# EAGLE design level_shift_panel (EAGLE 9.4.2)
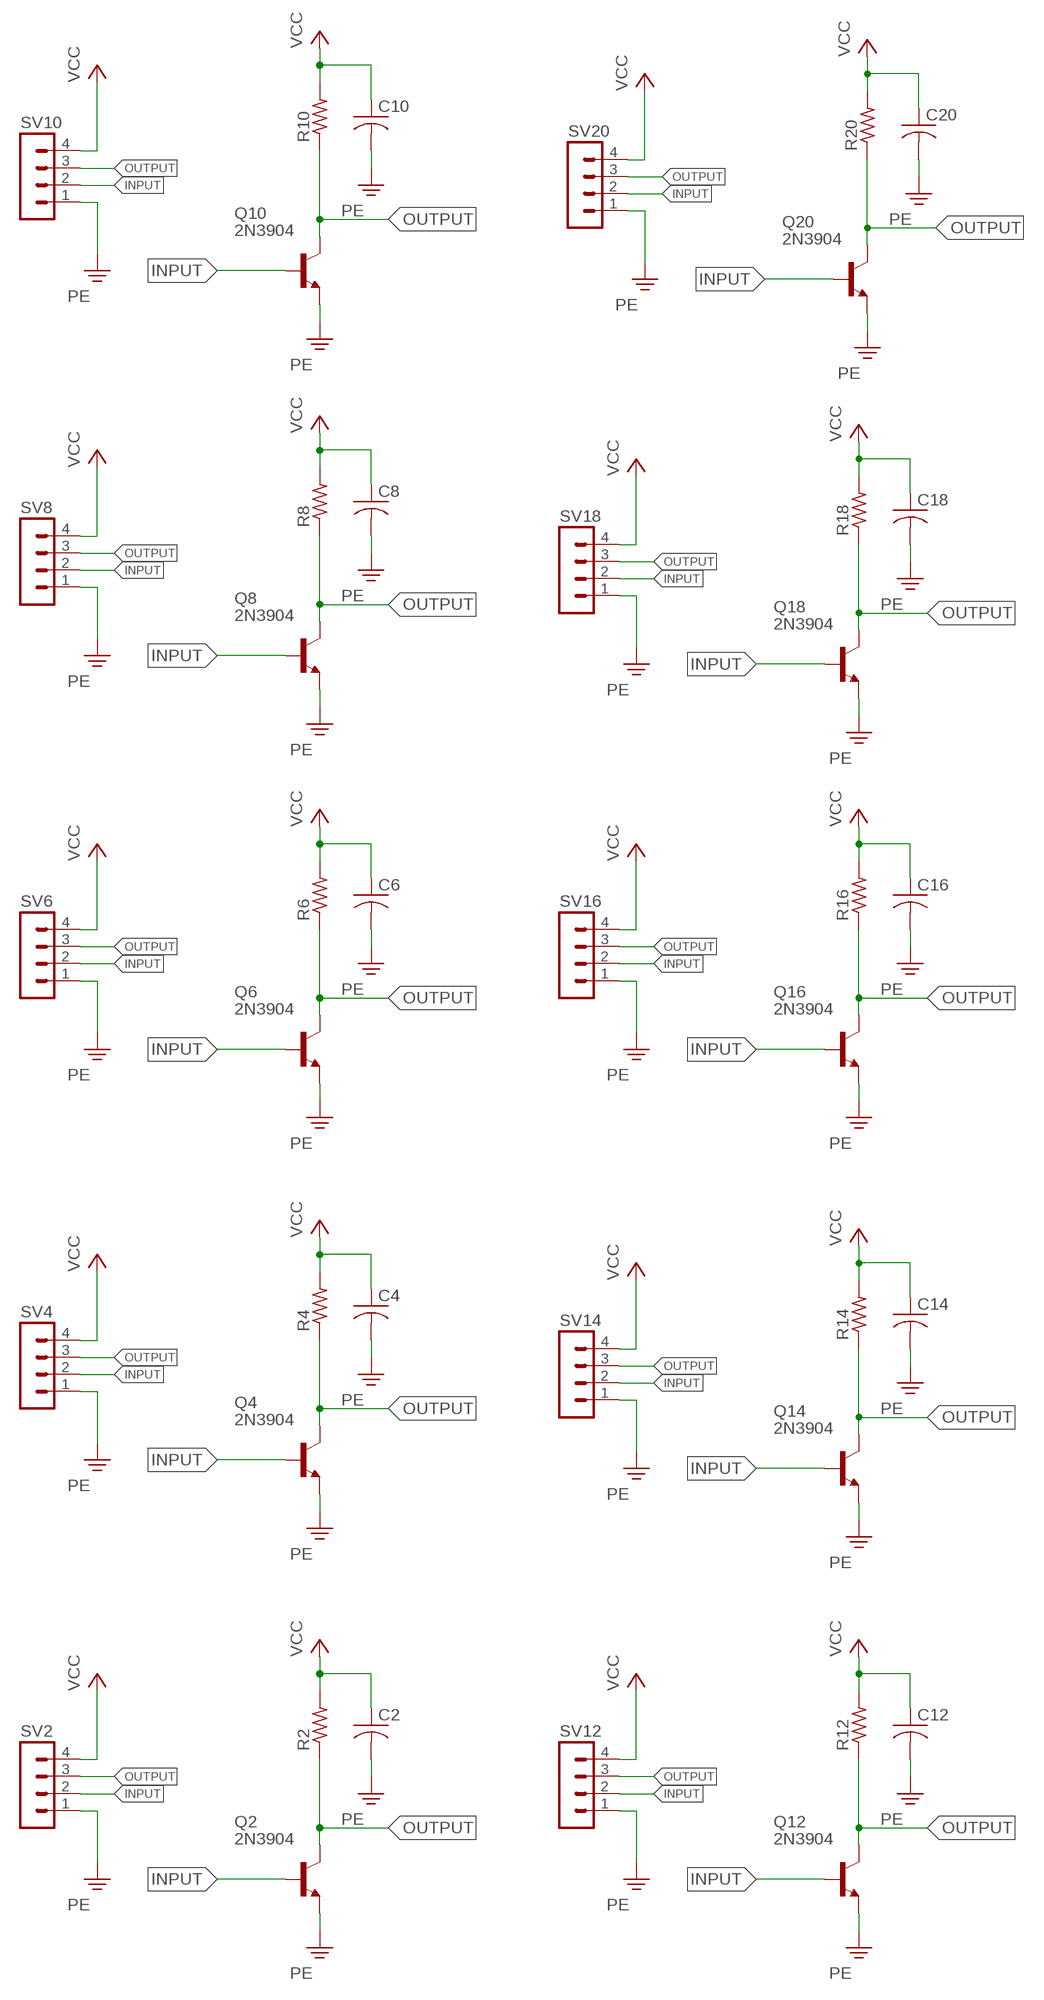
[diagram p0: schematic, sheet 1]

## Parts
C2  C-US025-030X050  [C025-030X050]
C4  C-US025-030X050  [C025-030X050]
C6  C-US025-030X050  [C025-030X050]
C8  C-US025-030X050  [C025-030X050]
C10  C-US025-030X050  [C025-030X050]
C12  C-US025-030X050  [C025-030X050]
C14  C-US025-030X050  [C025-030X050]
C16  C-US025-030X050  [C025-030X050]
C18  C-US025-030X050  [C025-030X050]
C20  C-US025-030X050  [C025-030X050]
Q2  2N3904  [TO-92]
Q4  2N3904  [TO-92]
Q6  2N3904  [TO-92]
Q8  2N3904  [TO-92]
Q10  2N3904  [TO-92]
Q12  2N3904  [TO-92]
Q14  2N3904  [TO-92]
Q16  2N3904  [TO-92]
Q18  2N3904  [TO-92]
Q20  2N3904  [TO-92]
R2  R-US_0204/7  [0204/7]
R4  R-US_0204/7  [0204/7]
R6  R-US_0204/7  [0204/7]
R8  R-US_0204/7  [0204/7]
R10  R-US_0204/7  [0204/7]
R12  R-US_0204/7  [0204/7]
R14  R-US_0204/7  [0204/7]
R16  R-US_0204/7  [0204/7]
R18  R-US_0204/7  [0204/7]
R20  R-US_0204/7  [0204/7]
SV2  MA04-1  [MA04-1]
SV4  MA04-1  [MA04-1]
SV6  MA04-1  [MA04-1]
SV8  MA04-1  [MA04-1]
SV10  MA04-1  [MA04-1]
SV12  MA04-1  [MA04-1]
SV14  MA04-1  [MA04-1]
SV16  MA04-1  [MA04-1]
SV18  MA04-1  [MA04-1]
SV20  MA04-1  [MA04-1]

## Nets
INPUT: Q2.B Q4.B Q6.B Q8.B Q10.B Q12.B Q14.B Q16.B Q18.B Q20.B SV2.2 SV4.2 SV6.2 SV8.2 SV10.2 SV12.2 SV14.2 SV16.2 SV18.2 SV20.2
OUTPUT: Q2.C Q4.C Q6.C Q8.C Q10.C Q12.C Q14.C Q16.C Q18.C Q20.C R2.1 R4.1 R6.1 R8.1 R10.1 R12.1 R14.1 R16.1 R18.1 R20.1 SV2.3 SV4.3 SV6.3 SV8.3 SV10.3 SV12.3 SV14.3 SV16.3 SV18.3 SV20.3
PE: C2.2 C4.2 C6.2 C8.2 C10.2 C12.2 C14.2 C16.2 C18.2 C20.2 Q2.E Q4.E Q6.E Q8.E Q10.E Q12.E Q14.E Q16.E Q18.E Q20.E SV2.1 SV4.1 SV6.1 SV8.1 SV10.1 SV12.1 SV14.1 SV16.1 SV18.1 SV20.1
VCC: C2.1 C4.1 C6.1 C8.1 C10.1 C12.1 C14.1 C16.1 C18.1 C20.1 R2.2 R4.2 R6.2 R8.2 R10.2 R12.2 R14.2 R16.2 R18.2 R20.2 SV2.4 SV4.4 SV6.4 SV8.4 SV10.4 SV12.4 SV14.4 SV16.4 SV18.4 SV20.4

## Library data of the parts
C2 C4 C6 C8 C10 C12 C14 C16 C18 C20 = rcl:C-US: CAPACITOR, American symbol; SPICEPREFIX: C
Q2 Q4 Q6 Q8 Q10 Q12 Q14 Q16 Q18 Q20 = transistors:2N3904
R2 R4 R6 R8 R10 R12 R14 R16 R18 R20 = rcl:R-US_: RESISTOR, American symbol; SPICEPREFIX: R
SV2 SV4 SV6 SV8 SV10 SV12 SV14 SV16 SV18 SV20 = con-lstb:MA04-1: PIN HEADER; OC_FARNELL: unknown; OC_NEWARK: unknown

## Board
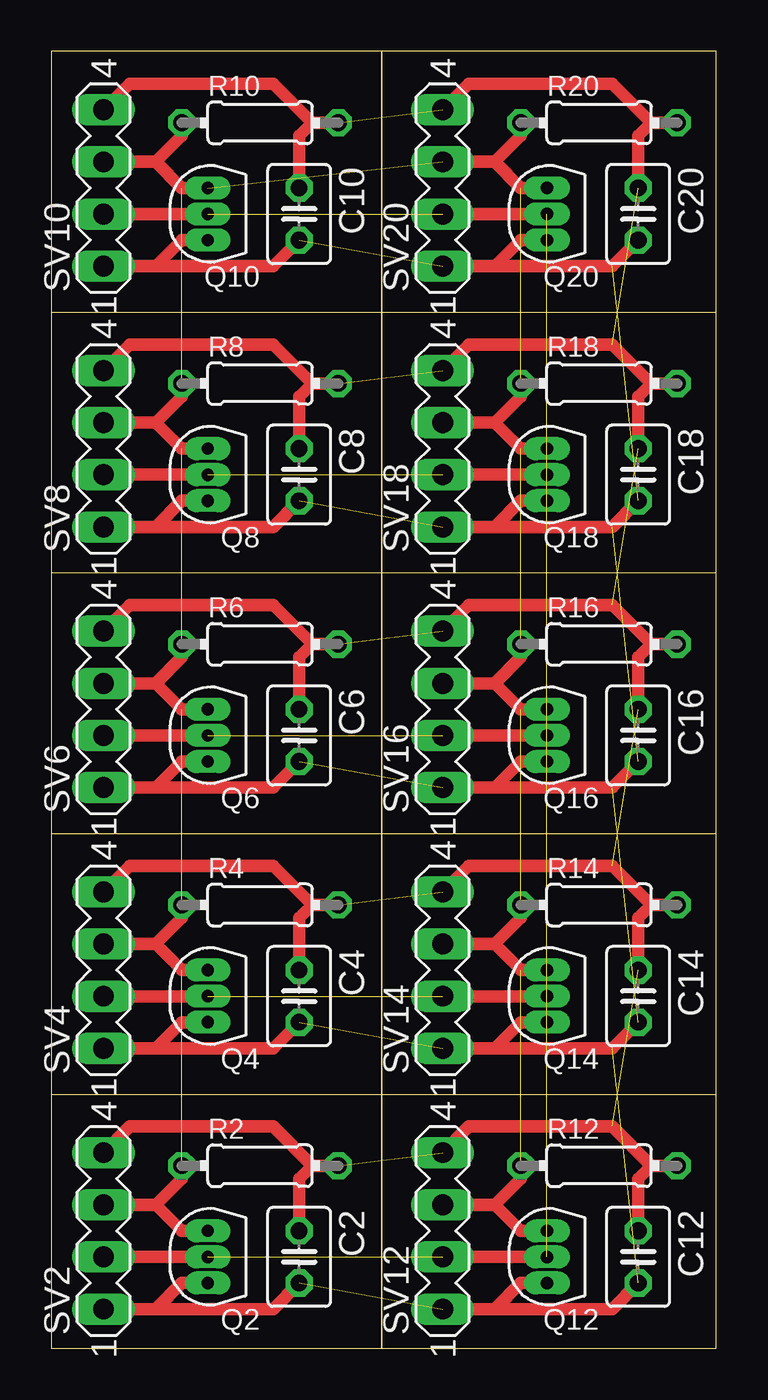
[diagram p1: board, top side]

Size 32.38 x 63.17 mm. Coordinates in mm from the lower left corner, seen from the top.
Outline: 16.08,0 0,0 0,12.37
Outline: 16.08,0 16.08,12.37
Outline: 0,12.37 16.08,12.37
Outline: 16.08,12.37 16.08,25.07
Outline: 0,25.07 0,12.37
Outline: 0,25.07 16.08,25.07
Outline: 16.08,25.07 16.08,37.77
Outline: 0,37.77 0,25.07
Outline: 0,37.77 16.08,37.77
Outline: 16.08,37.77 16.08,50.47
Outline: 0,50.47 0,37.77
Outline: 0,50.47 16.08,50.47
Outline: 16.08,50.47 16.08,63.17
Outline: 16.08,63.17 0,63.17 0,50.47
Outline: 16.08,0 32.37,0 32.37,12.37
Outline: 16.08,12.37 16.08,0
Outline: 16.08,12.37 32.37,12.37
Outline: 32.37,12.37 32.37,25.07
Outline: 16.08,25.07 16.08,12.37
Outline: 16.08,25.07 32.37,25.07
Outline: 32.37,25.07 32.37,37.77
Outline: 16.08,37.77 16.08,25.07
Outline: 16.08,37.77 32.37,37.77
Outline: 32.37,37.77 32.38,50.47
Outline: 16.08,50.47 16.08,37.77
Outline: 16.08,50.47 32.38,50.47
Outline: 32.38,50.47 32.38,63.17 16.08,63.17
Outline: 16.08,63.17 16.08,50.47
Copper layers (1*16): Top 0.035mm / dielectric 1.5mm / Bottom 0.035mm
Design rules "default": minimum track width 6mil, minimum drill 0.35mm, track to track 6mil, track to pad 6mil, pad to pad 6mil, via to via 6mil, smd to smd 6mil, copper to edge 40mil, drill to drill 6mil, minimum pad ring 10mil, minimum via ring 8mil, stop-mask expansion 4mil, vias tented up to drill 0mil, thermal gap 10mil

### Footprints (pad centres in the part's own frame; a part is rotated, then mirrored left to right if it is on the bottom)
C025-030X050 = drill 0.813 octagon: 1 -1.27,0; 2 1.27,0
TO-92 = drill 0.6 pad 0.762 long: B 0,0; C 0,-1.27; E 0,1.27
0204/7 = drill 0.813 octagon: 1 -3.81,0; 2 3.81,0
MA04-1 = drill 1.016 long: 1 -3.81,0; 2 -1.27,0; 3 1.27,0; 4 3.81,0

### Placement (x,y rotation side)
C2  12.07,4.45 270 top
C4  12.07,17.14 270 top
C6  12.07,29.85 270 top
C8  12.07,42.55 270 top
C10  12.07,55.25 270 top
C12  28.57,4.45 270 top
C14  28.57,17.14 270 top
C16  28.57,29.85 270 top
C18  28.57,42.55 270 top
C20  28.57,55.25 270 top
Q2  7.62,4.45 180 top
Q4  7.62,17.14 180 top
Q6  7.62,29.85 180 top
Q8  7.62,42.55 180 top
Q10  7.62,55.25 180 top
Q12  24.13,4.45 180 top
Q14  24.13,17.14 180 top
Q16  24.13,29.85 180 top
Q18  24.13,42.55 180 top
Q20  24.13,55.25 180 top
R2  10.16,8.89 0 top
R4  10.16,21.59 0 top
R6  10.16,34.29 0 top
R8  10.16,46.99 0 top
R10  10.16,59.69 0 top
R12  26.67,8.89 0 top
R14  26.67,21.59 0 top
R16  26.67,34.29 0 top
R18  26.67,46.99 0 top
R20  26.67,59.69 0 top
SV2  2.54,5.72 90 top
SV4  2.54,18.41 90 top
SV6  2.54,31.11 90 top
SV8  2.54,43.82 90 top
SV10  2.54,56.52 90 top
SV12  19.05,5.72 90 top
SV14  19.05,18.41 90 top
SV16  19.05,31.11 90 top
SV18  19.05,43.82 90 top
SV20  19.05,56.52 90 top

### Tracks (layer width: path | path; a pad name or v marks a point on that pad's centre or on a via)
INPUT  (9 unrouted)
  Top 0.61: SV2.2 Q2.B | SV4.2 Q4.B | SV6.2 Q6.B | SV8.2 Q8.B | SV10.2 Q10.B | SV12.2 Q12.B | SV14.2 Q14.B | SV16.2 Q16.B | SV18.2 Q18.B | SV20.2 Q20.B
OUTPUT  (9 unrouted)
  Top 0.61: 5.08,6.99 SV2.3 3.17,6.99 | Q2.C 6.35,5.72 5.08,6.99 | R2.1 6.35,8.25 5.08,6.99 | 5.08,19.68 SV4.3 3.17,19.68 | Q4.C 6.35,18.41 5.08,19.68 | R4.1 6.35,20.95 5.08,19.68 | 5.08,32.39 SV6.3 3.17,32.39 | Q6.C 6.35,31.11 5.08,32.39 | R6.1 6.35,33.66 5.08,32.39 | 5.08,45.09 SV8.3 3.17,45.09 | Q8.C 6.35,43.82 5.08,45.09 | R8.1 6.35,46.36 5.08,45.09 | 5.08,57.79 SV10.3 3.17,57.79 | Q10.C 6.35,56.52 5.08,57.79 | R10.1 6.35,59.05 5.08,57.79 | 21.59,6.99 SV12.3 19.69,6.99 | Q12.C 22.86,5.72 21.59,6.99 | R12.1 22.86,8.25 21.59,6.99 | 21.59,19.68 SV14.3 19.69,19.68 | Q14.C 22.86,18.41 21.59,19.68 | R14.1 22.86,20.95 21.59,19.68 | 21.59,32.39 SV16.3 19.69,32.39 | Q16.C 22.86,31.11 21.59,32.39 | R16.1 22.86,33.66 21.59,32.39 | 21.59,45.09 SV18.3 19.69,45.09 | Q18.C 22.86,43.82 21.59,45.09 | R18.1 22.86,46.36 21.59,45.09 | 21.59,57.79 SV20.3 19.69,57.79 | Q20.C 22.86,56.52 21.59,57.79 | R20.1 22.86,59.05 21.59,57.79
PE  (9 unrouted)
  Top 0.61: SV2.1 5.08,1.91 | Q2.E 6.35,3.17 5.08,1.91 | 5.08,1.91 10.8,1.91 C2.2 | SV4.1 5.08,14.61 | Q4.E 6.35,15.88 5.08,14.61 | 5.08,14.61 10.8,14.61 C4.2 | SV6.1 5.08,27.3 | Q6.E 6.35,28.57 5.08,27.3 | 5.08,27.3 10.8,27.3 C6.2 | SV8.1 5.08,40.01 | Q8.E 6.35,41.28 5.08,40.01 | 5.08,40.01 10.8,40.01 C8.2 | SV10.1 5.08,52.71 | Q10.E 6.35,53.98 5.08,52.71 | 5.08,52.71 10.8,52.71 C10.2 | SV12.1 21.59,1.91 | Q12.E 22.86,3.17 21.59,1.91 | 21.59,1.91 27.3,1.91 C12.2 | SV14.1 21.59,14.61 | Q14.E 22.86,15.88 21.59,14.61 | 21.59,14.61 27.3,14.61 C14.2 | SV16.1 21.59,27.3 | Q16.E 22.86,28.57 21.59,27.3 | 21.59,27.3 27.3,27.3 C16.2 | SV18.1 21.59,40.01 | Q18.E 22.86,41.28 21.59,40.01 | 21.59,40.01 27.3,40.01 C18.2 | SV20.1 21.59,52.71 | Q20.E 22.86,53.98 21.59,52.71 | 21.59,52.71 27.3,52.71 C20.2
VCC  (9 unrouted)
  Top 0.152: C2.1 11.75,6.03 | C4.1 11.75,18.73 | C6.1 11.75,31.43 | C8.1 11.75,44.13 | C10.1 11.75,56.83 | C12.1 28.26,6.03 | C14.1 28.26,18.73 | C16.1 28.26,31.43 | C18.1 28.26,44.13 | C20.1 28.26,56.83
  Top 0.61: SV2.4 3.81,10.8 10.8,10.8 12.7,8.89 | R2.2 12.7,8.89 | 12.7,8.89 12.07,8.25 C2.1 | SV4.4 3.81,23.5 10.8,23.5 12.7,21.59 | R4.2 12.7,21.59 | 12.7,21.59 12.07,20.95 C4.1 | SV6.4 3.81,36.2 10.8,36.2 12.7,34.29 | R6.2 12.7,34.29 | 12.7,34.29 12.07,33.66 C6.1 | SV8.4 3.81,48.9 10.8,48.9 12.7,46.99 | R8.2 12.7,46.99 | 12.7,46.99 12.07,46.36 C8.1 | SV10.4 3.81,61.59 10.8,61.59 12.7,59.69 | R10.2 12.7,59.69 | 12.7,59.69 12.07,59.05 C10.1 | SV12.4 20.32,10.8 27.3,10.8 29.21,8.89 | R12.2 29.21,8.89 | 29.21,8.89 28.57,8.25 C12.1 | SV14.4 20.32,23.5 27.3,23.5 29.21,21.59 | R14.2 29.21,21.59 | 29.21,21.59 28.57,20.95 C14.1 | SV16.4 20.32,36.2 27.3,36.2 29.21,34.29 | R16.2 29.21,34.29 | 29.21,34.29 28.57,33.66 C16.1 | SV18.4 20.32,48.9 27.3,48.9 29.21,46.99 | R18.2 29.21,46.99 | 29.21,46.99 28.57,46.36 C18.1 | SV20.4 20.32,61.59 27.3,61.59 29.21,59.69 | R20.2 29.21,59.69 | 29.21,59.69 28.57,59.05 C20.1